# EAGLE design RPi_Extension_load (EAGLE 7.6.0)
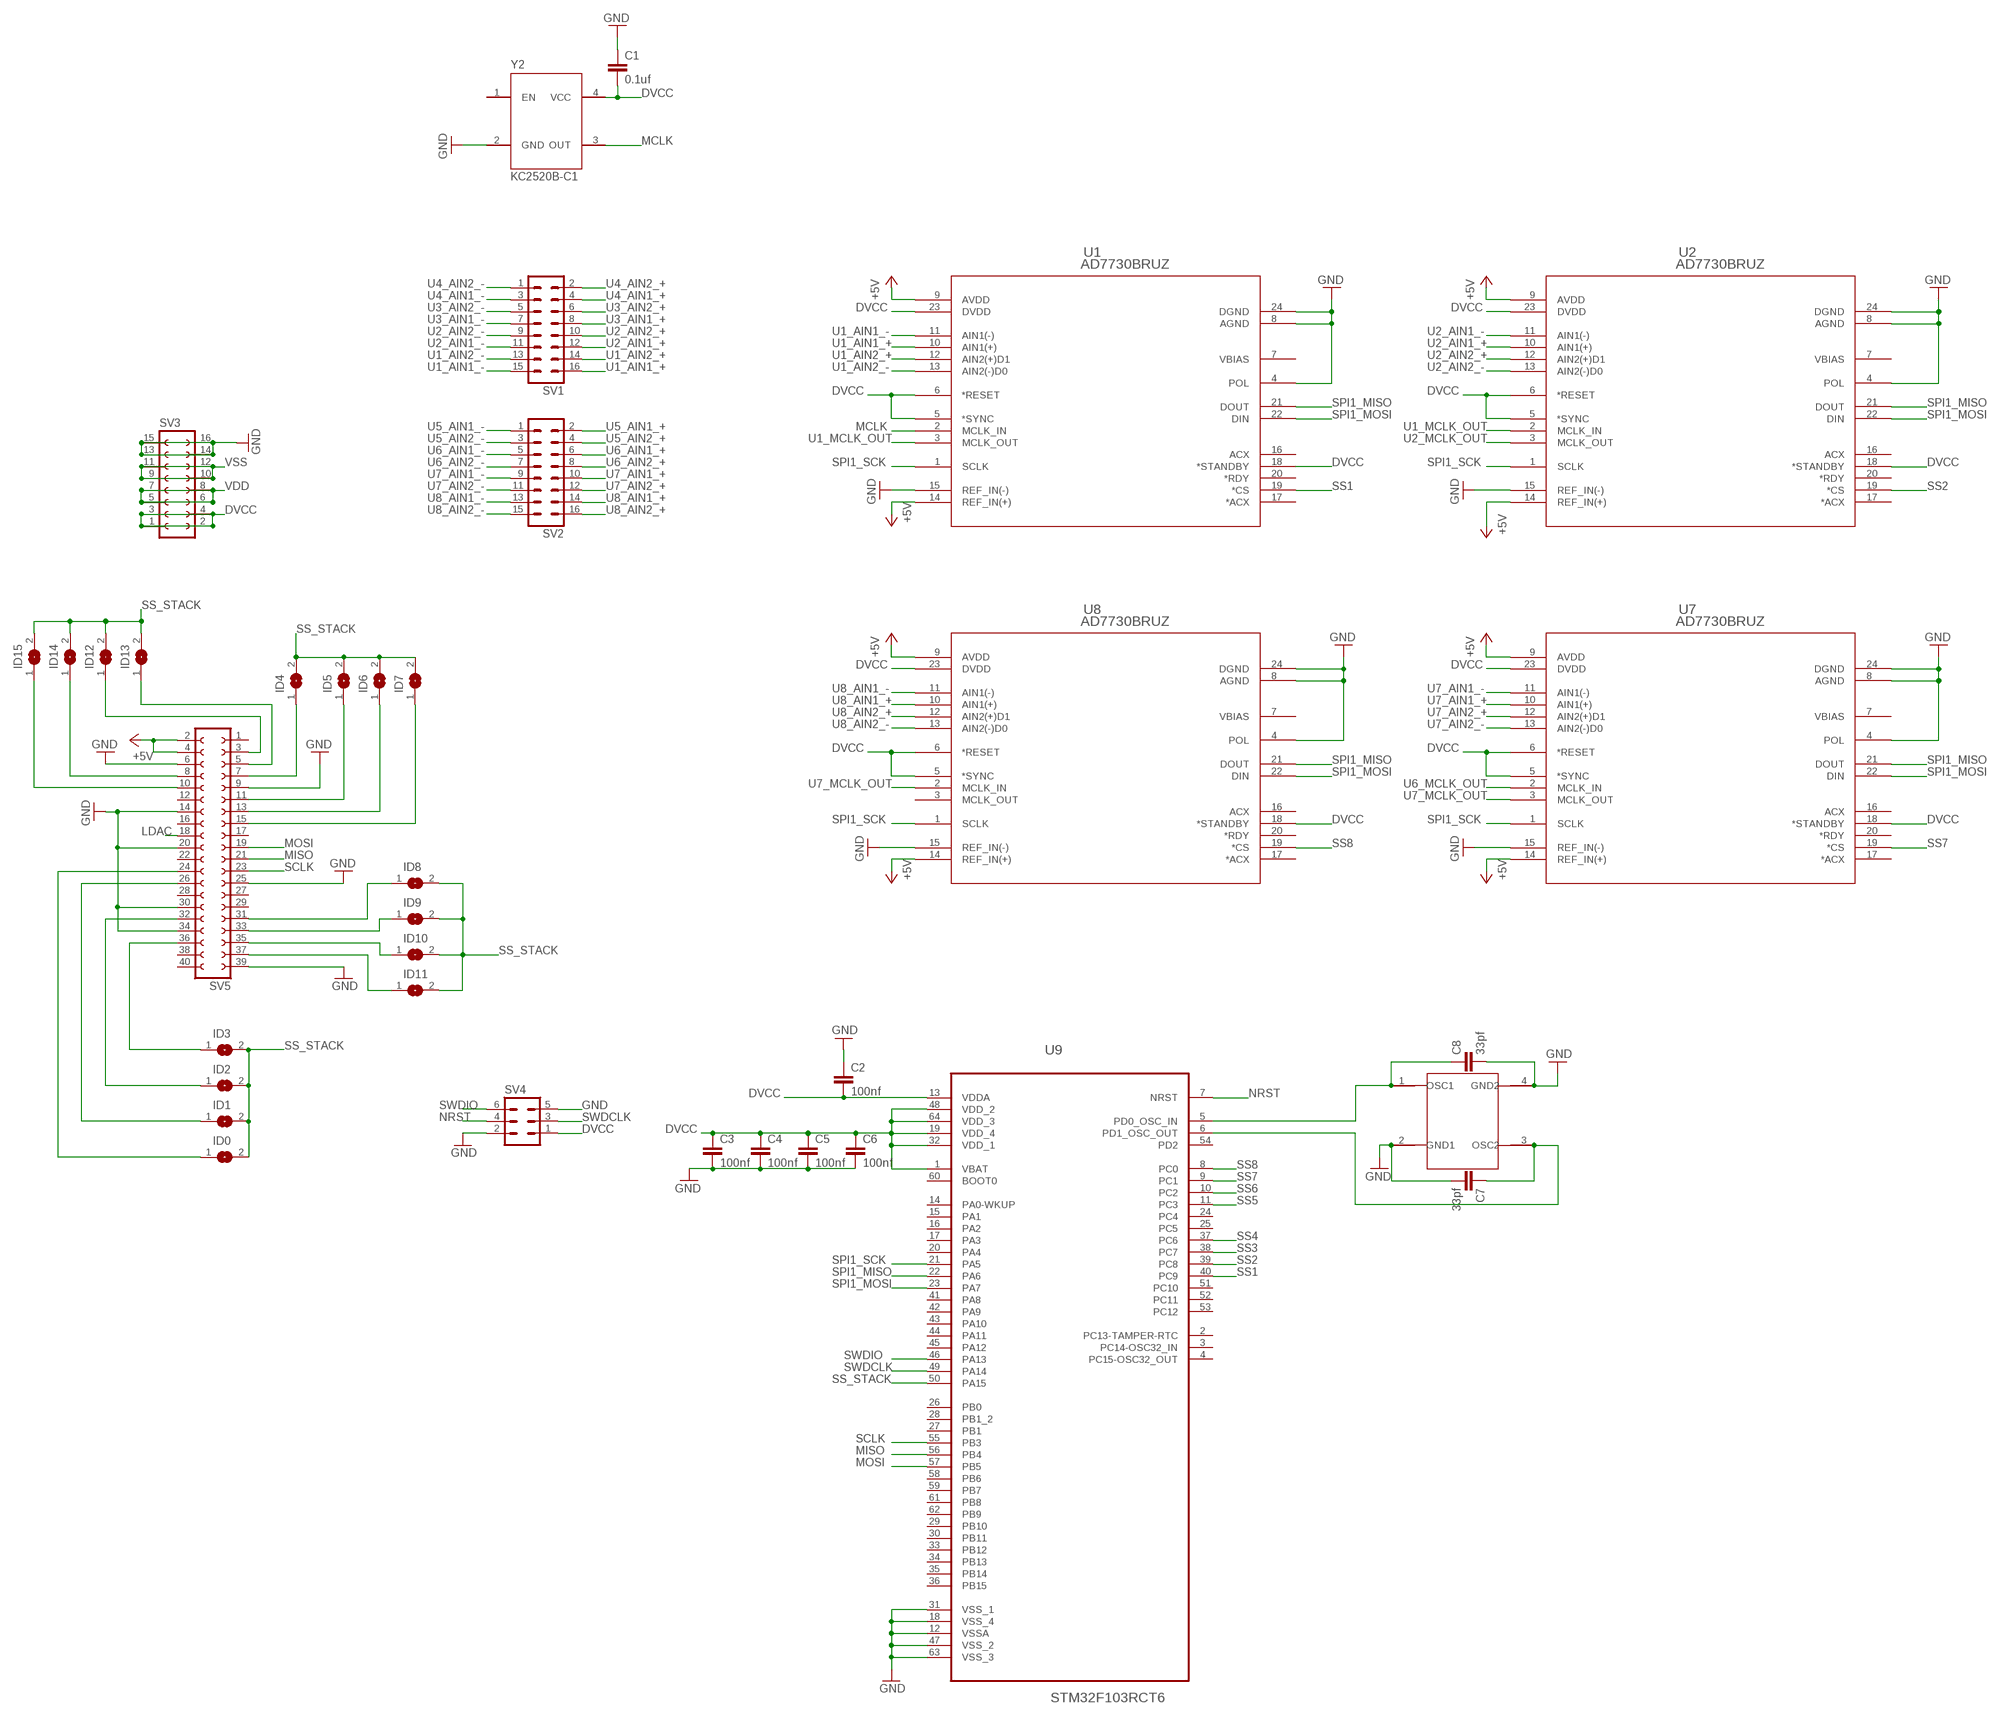
[diagram p0: schematic, sheet 1, part 1 of 2]
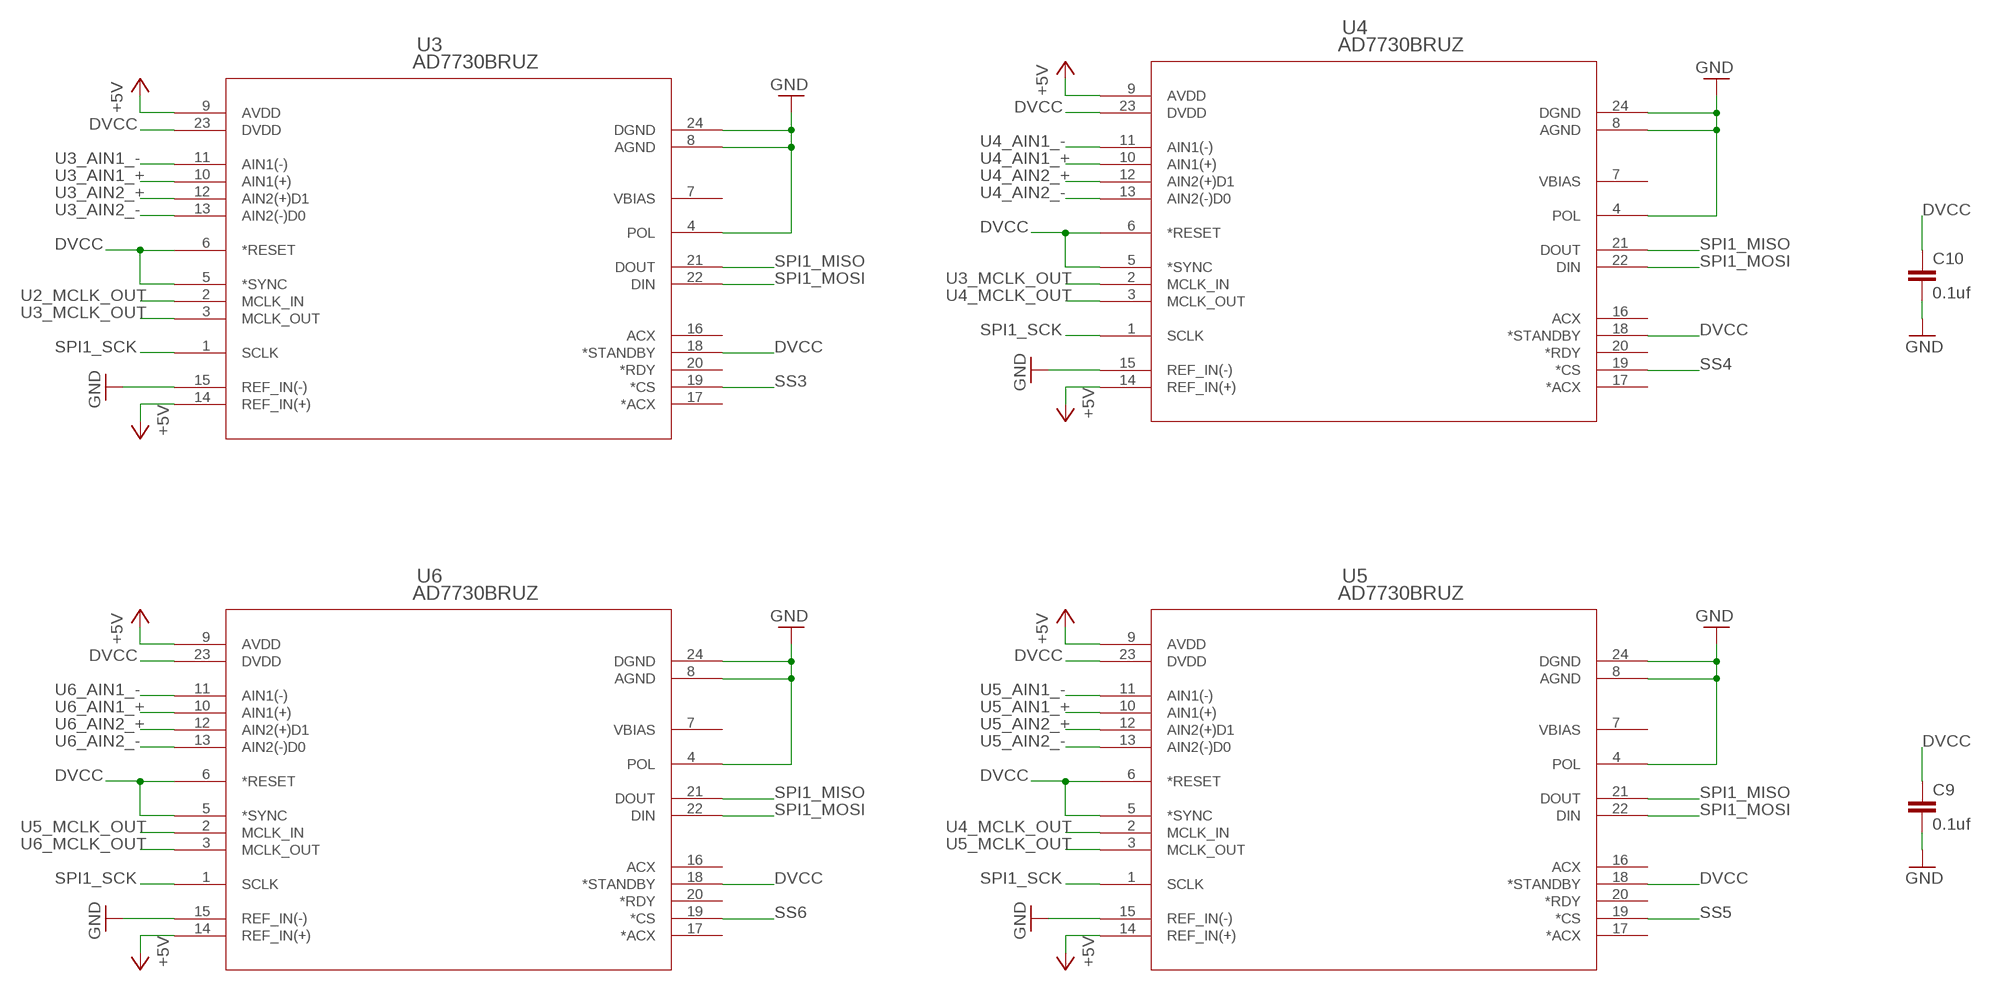
[diagram p1: schematic, sheet 1, part 2 of 2]

## Parts
C1  0.1uf  C-EUC0603  [C0603]
C2  100nf  C-EUC0603  [C0603]
C3  100nf  C-EUC0603  [C0603]
C4  100nf  C-EUC0603  [C0603]
C5  100nf  C-EUC0603  [C0603]
C6  100nf  C-EUC0603  [C0603]
C7  33pf  C-EUC0603  [C0603]
C8  33pf  C-EUC0603  [C0603]
C9  0.1uf  C-EUC0603  [C0603]
C10  0.1uf  C-EUC0603  [C0603]
ID0  SJ  [SJ]
ID1  SJ  [SJ]
ID2  SJ  [SJ]
ID3  SJ  [SJ]
ID4  SJ  [SJ]
ID5  SJ  [SJ]
ID6  SJ  [SJ]
ID7  SJ  [SJ]
ID8  SJ  [SJ]
ID9  SJ  [SJ]
ID10  SJ  [SJ]
ID11  SJ  [SJ]
ID12  SJ  [SJ]
ID13  SJ  [SJ]
ID14  SJ  [SJ]
ID15  SJ  [SJ]
SV1  MA08-2W  [MA08-2W]
SV2  MA08-2W  [MA08-2W]
SV3  FE08-2  [FE08-2]
SV4  MA03-2  [MA03-2]
SV5  FE20-2  [FE20-2]
U1  AD7730BRUZ  [RU_24]
U2  AD7730BRUZ  [RU_24]
U3  AD7730BRUZ  [RU_24]
U4  AD7730BRUZ  [RU_24]
U5  AD7730BRUZ  [RU_24]
U6  AD7730BRUZ  [RU_24]
U7  AD7730BRUZ  [RU_24]
U8  AD7730BRUZ  [RU_24]
U9  STM32F103RCT6  [QFP50P1200X1200X160-64N]
Y1  ABM3B  [ABM3B]
Y2  KC2520B-C1  [KC2520B-C1]

## Nets
+5V: SV5.2 SV5.4 U1.9(AVDD) U1.14(REF_IN(+)) U2.9(AVDD) U2.14(REF_IN(+)) U3.9(AVDD) U3.14(REF_IN(+)) U4.9(AVDD) U4.14(REF_IN(+)) U5.9(AVDD) U5.14(REF_IN(+)) U6.9(AVDD) U6.14(REF_IN(+)) U7.9(AVDD) U7.14(REF_IN(+)) U8.9(AVDD) U8.14(REF_IN(+))
DVCC: C1.2 C2.2 C3.1 C4.1 C5.1 C6.1 C9.1 C10.1 SV3.1 SV3.2 SV3.3 SV3.4 SV4.1 U1.5(*SYNC) U1.6(*RESET) U1.18(*STANDBY) U1.23(DVDD) U2.5(*SYNC) U2.6(*RESET) U2.18(*STANDBY) U2.23(DVDD) U3.5(*SYNC) U3.6(*RESET) U3.18(*STANDBY) U3.23(DVDD) U4.5(*SYNC) U4.6(*RESET) U4.18(*STANDBY) U4.23(DVDD) U5.5(*SYNC) U5.6(*RESET) U5.18(*STANDBY) U5.23(DVDD) U6.5(*SYNC) U6.6(*RESET) U6.18(*STANDBY) U6.23(DVDD) U7.5(*SYNC) U7.6(*RESET) U7.18(*STANDBY) U7.23(DVDD) U8.5(*SYNC) U8.6(*RESET) U8.18(*STANDBY) U8.23(DVDD) U9.1(VBAT) U9.13(VDDA) U9.19(VDD_4) U9.32(VDD_1) U9.48(VDD_2) U9.64(VDD_3) Y2.4(VCC)
GND: C1.1 C2.1 C3.2 C4.2 C5.2 C6.2 C7.2 C8.2 C9.2 C10.2 SV3.13 SV3.14 SV3.15 SV3.16 SV4.2 SV4.5 SV5.6 SV5.9 SV5.14 SV5.20 SV5.25 SV5.30 SV5.34 SV5.39 U1.4(POL) U1.8(AGND) U1.15(REF_IN(-)) U1.24(DGND) U2.4(POL) U2.8(AGND) U2.15(REF_IN(-)) U2.24(DGND) U3.4(POL) U3.8(AGND) U3.15(REF_IN(-)) U3.24(DGND) U4.4(POL) U4.8(AGND) U4.15(REF_IN(-)) U4.24(DGND) U5.4(POL) U5.8(AGND) U5.15(REF_IN(-)) U5.24(DGND) U6.4(POL) U6.8(AGND) U6.15(REF_IN(-)) U6.24(DGND) U7.4(POL) U7.8(AGND) U7.15(REF_IN(-)) U7.24(DGND) U8.4(POL) U8.8(AGND) U8.15(REF_IN(-)) U8.24(DGND) U9.12(VSSA) U9.18(VSS_4) U9.31(VSS_1) U9.47(VSS_2) U9.63(VSS_3) Y1.2(GND1) Y1.4(GND2) Y2.2(GND)
LDAC: SV5.18
MCLK: U1.2(MCLK_IN) Y2.3(OUT)
MISO: SV5.21 U9.56(PB4)
MOSI: SV5.19 U9.57(PB5)
N$1: ID11.1 SV5.37
N$2: C8.1 U9.5(PD0_OSC_IN) Y1.1(OSC1)
N$3: C7.1 U9.6(PD1_OSC_OUT) Y1.3(OSC2)
N$4: ID10.1 SV5.35
N$5: ID9.1 SV5.33
N$6: ID8.1 SV5.31
N$7: ID14.1 SV5.8
N$8: ID15.1 SV5.10
N$9: ID12.1 SV5.3
N$10: ID13.1 SV5.5
N$20: ID3.1 SV5.36
N$21: ID4.1 SV5.7
N$22: ID2.1 SV5.32
N$23: ID1.1 SV5.26
N$24: ID0.1 SV5.24
N$25: ID5.1 SV5.11
N$26: ID6.1 SV5.13
N$27: ID7.1 SV5.15
NRST: SV4.4 U9.7(NRST)
SCLK: SV5.23 U9.55(PB3)
SPI1_MISO: U1.21(DOUT) U2.21(DOUT) U3.21(DOUT) U4.21(DOUT) U5.21(DOUT) U6.21(DOUT) U7.21(DOUT) U8.21(DOUT) U9.22(PA6)
SPI1_MOSI: U1.22(DIN) U2.22(DIN) U3.22(DIN) U4.22(DIN) U5.22(DIN) U6.22(DIN) U7.22(DIN) U8.22(DIN) U9.23(PA7)
SPI1_SCK: U1.1(SCLK) U2.1(SCLK) U3.1(SCLK) U4.1(SCLK) U5.1(SCLK) U6.1(SCLK) U7.1(SCLK) U8.1(SCLK) U9.21(PA5)
SS1: U1.19(*CS) U9.40(PC9)
SS2: U2.19(*CS) U9.39(PC8)
SS3: U3.19(*CS) U9.38(PC7)
SS4: U4.19(*CS) U9.37(PC6)
SS5: U5.19(*CS) U9.11(PC3)
SS6: U6.19(*CS) U9.10(PC2)
SS7: U7.19(*CS) U9.9(PC1)
SS8: U8.19(*CS) U9.8(PC0)
SS_STACK: ID0.2 ID1.2 ID2.2 ID3.2 ID4.2 ID5.2 ID6.2 ID7.2 ID8.2 ID9.2 ID10.2 ID11.2 ID12.2 ID13.2 ID14.2 ID15.2 U9.50(PA15)
SWDCLK: SV4.3 U9.49(PA14)
SWDIO: SV4.6 U9.46(PA13)
U1_AIN1_+: SV1.16 U1.10(AIN1(+))
U1_AIN1_-: SV1.15 U1.11(AIN1(-))
U1_AIN2_+: SV1.14 U1.12(AIN2(+)D1)
U1_AIN2_-: SV1.13 U1.13(AIN2(-)D0)
U1_MCLK_OUT: U1.3(MCLK_OUT) U2.2(MCLK_IN)
U2_AIN1_+: SV1.12 U2.10(AIN1(+))
U2_AIN1_-: SV1.11 U2.11(AIN1(-))
U2_AIN2_+: SV1.10 U2.12(AIN2(+)D1)
U2_AIN2_-: SV1.9 U2.13(AIN2(-)D0)
U2_MCLK_OUT: U2.3(MCLK_OUT) U3.2(MCLK_IN)
U3_AIN1_+: SV1.8 U3.10(AIN1(+))
U3_AIN1_-: SV1.7 U3.11(AIN1(-))
U3_AIN2_+: SV1.6 U3.12(AIN2(+)D1)
U3_AIN2_-: SV1.5 U3.13(AIN2(-)D0)
U3_MCLK_OUT: U3.3(MCLK_OUT) U4.2(MCLK_IN)
U4_AIN1_+: SV1.4 U4.10(AIN1(+))
U4_AIN1_-: SV1.3 U4.11(AIN1(-))
U4_AIN2_+: SV1.2 U4.12(AIN2(+)D1)
U4_AIN2_-: SV1.1 U4.13(AIN2(-)D0)
U4_MCLK_OUT: U4.3(MCLK_OUT) U5.2(MCLK_IN)
U5_AIN1_+: SV2.2 U5.10(AIN1(+))
U5_AIN1_-: SV2.1 U5.11(AIN1(-))
U5_AIN2_+: SV2.4 U5.12(AIN2(+)D1)
U5_AIN2_-: SV2.3 U5.13(AIN2(-)D0)
U5_MCLK_OUT: U5.3(MCLK_OUT) U6.2(MCLK_IN)
U6_AIN1_+: SV2.6 U6.10(AIN1(+))
U6_AIN1_-: SV2.5 U6.11(AIN1(-))
U6_AIN2_+: SV2.8 U6.12(AIN2(+)D1)
U6_AIN2_-: SV2.7 U6.13(AIN2(-)D0)
U6_MCLK_OUT: U6.3(MCLK_OUT) U7.2(MCLK_IN)
U7_AIN1_+: SV2.10 U7.10(AIN1(+))
U7_AIN1_-: SV2.9 U7.11(AIN1(-))
U7_AIN2_+: SV2.12 U7.12(AIN2(+)D1)
U7_AIN2_-: SV2.11 U7.13(AIN2(-)D0)
U7_MCLK_OUT: U7.3(MCLK_OUT) U8.2(MCLK_IN)
U8_AIN1_+: SV2.14 U8.10(AIN1(+))
U8_AIN1_-: SV2.13 U8.11(AIN1(-))
U8_AIN2_+: SV2.16 U8.12(AIN2(+)D1)
U8_AIN2_-: SV2.15 U8.13(AIN2(-)D0)
VDD: SV3.5 SV3.6 SV3.7 SV3.8
VSS: SV3.9 SV3.10 SV3.11 SV3.12
Unconnected: SV5.1 SV5.12 SV5.16 SV5.17 SV5.22 SV5.27 SV5.28 SV5.29 SV5.38 SV5.40 U1.7(VBIAS) U1.16(ACX) U1.17(*ACX) U1.20(*RDY) U2.7(VBIAS) U2.16(ACX) U2.17(*ACX) U2.20(*RDY) U3.7(VBIAS) U3.16(ACX) U3.17(*ACX) U3.20(*RDY) U4.7(VBIAS) U4.16(ACX) U4.17(*ACX) U4.20(*RDY) U5.7(VBIAS) U5.16(ACX) U5.17(*ACX) U5.20(*RDY) U6.7(VBIAS) U6.16(ACX) U6.17(*ACX) U6.20(*RDY) U7.7(VBIAS) U7.16(ACX) U7.17(*ACX) U7.20(*RDY) U8.3(MCLK_OUT) U8.7(VBIAS) U8.16(ACX) U8.17(*ACX) U8.20(*RDY) U9.2(PC13-TAMPER-RTC) U9.3(PC14-OSC32_IN) U9.4(PC15-OSC32_OUT) U9.14(PA0-WKUP) U9.15(PA1) U9.16(PA2) U9.17(PA3) U9.20(PA4) U9.24(PC4) U9.25(PC5) U9.26(PB0) U9.27(PB1) U9.28(PB1_2) U9.29(PB10) U9.30(PB11) U9.33(PB12) U9.34(PB13) U9.35(PB14) U9.36(PB15) U9.41(PA8) U9.42(PA9) U9.43(PA10) U9.44(PA11) U9.45(PA12) U9.51(PC10) U9.52(PC11) U9.53(PC12) U9.54(PD2) U9.58(PB6) U9.60(BOOT0) U9.61(PB8) U9.62(PB9) Y2.1(EN)

## Power pins joined to a net without a drawn wire
PB7: U9.59(PB7)

## Library data of the parts
C1-C10 = rcl:C-EU: CAPACITOR, European symbol
ID0 ID1-ID15 = jumper:SJ: SMD solder JUMPER
SV1 SV2 = con-lstb:MA08-2W: PIN HEADER; OC_FARNELL: unknown; OC_NEWARK: unknown
SV3 = con-lsta:FE08-2: FEMALE HEADER; OC_FARNELL: unknown; OC_NEWARK: unknown
SV4 = con-lstb:MA03-2: PIN HEADER; OC_FARNELL: unknown; OC_NEWARK: unknown
SV5 = con-lsta:FE20-2: FEMALE HEADER; OC_FARNELL: unknown; OC_NEWARK: unknown
U1-U8 = AD7730BRUZ:AD7730BRUZ
U9 = STM32F103RCT6:STM32F103RCT6: ARM-based 32-bit MCU; MPN: STM32F103RCT6; OC_FARNELL: 1624136; OC_NEWARK: 01P4099; PACKAGE: QFP-64; SUPPLIER: STMICROELECTRONICS
Y1 = ABM3B:ABM3B
Y2 = kc2520b_c1:KC2520B-C1

## Board
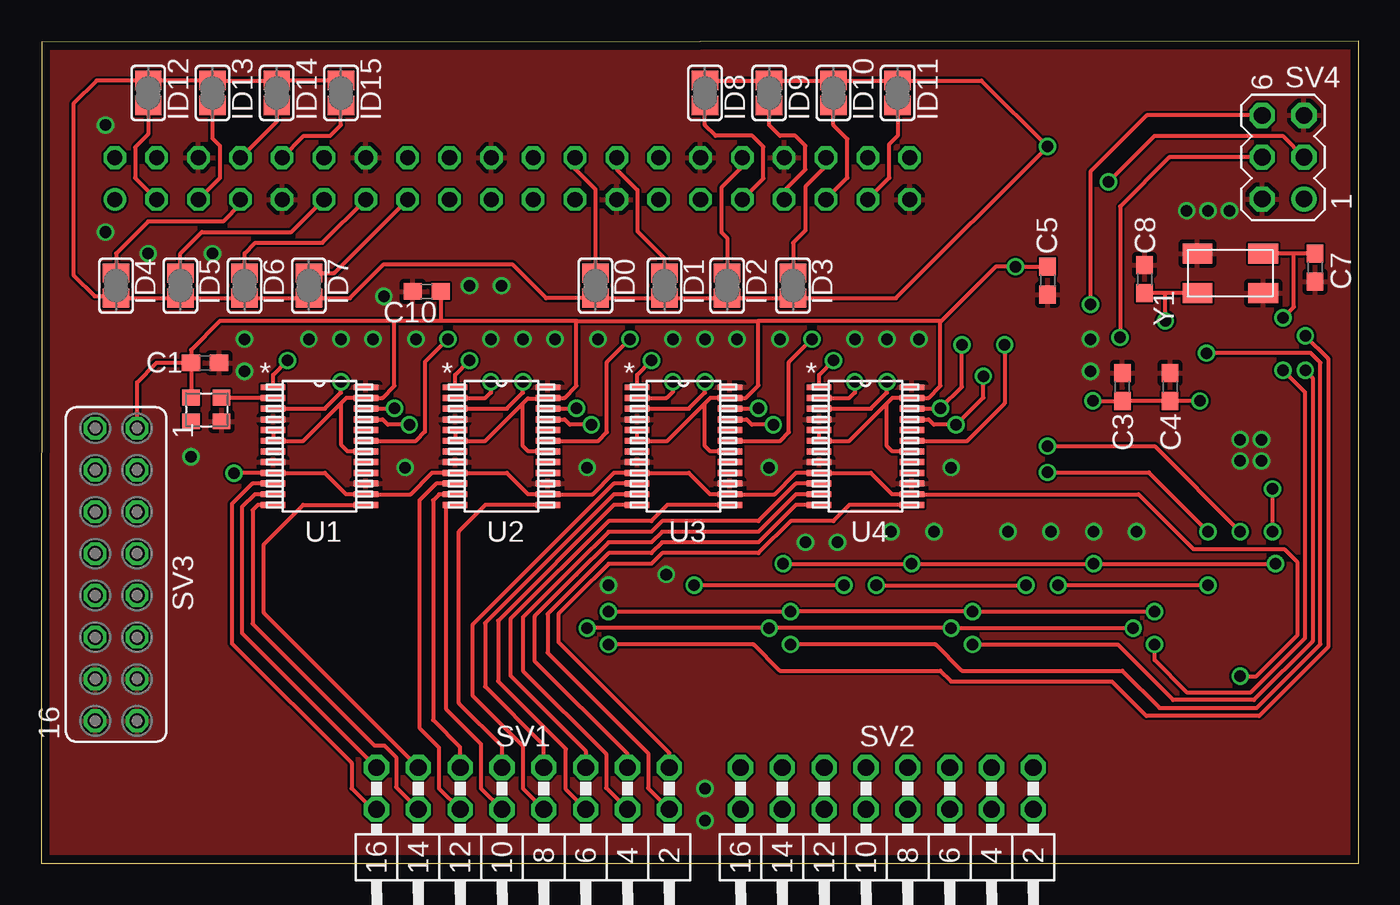
[diagram p2: board, top side]
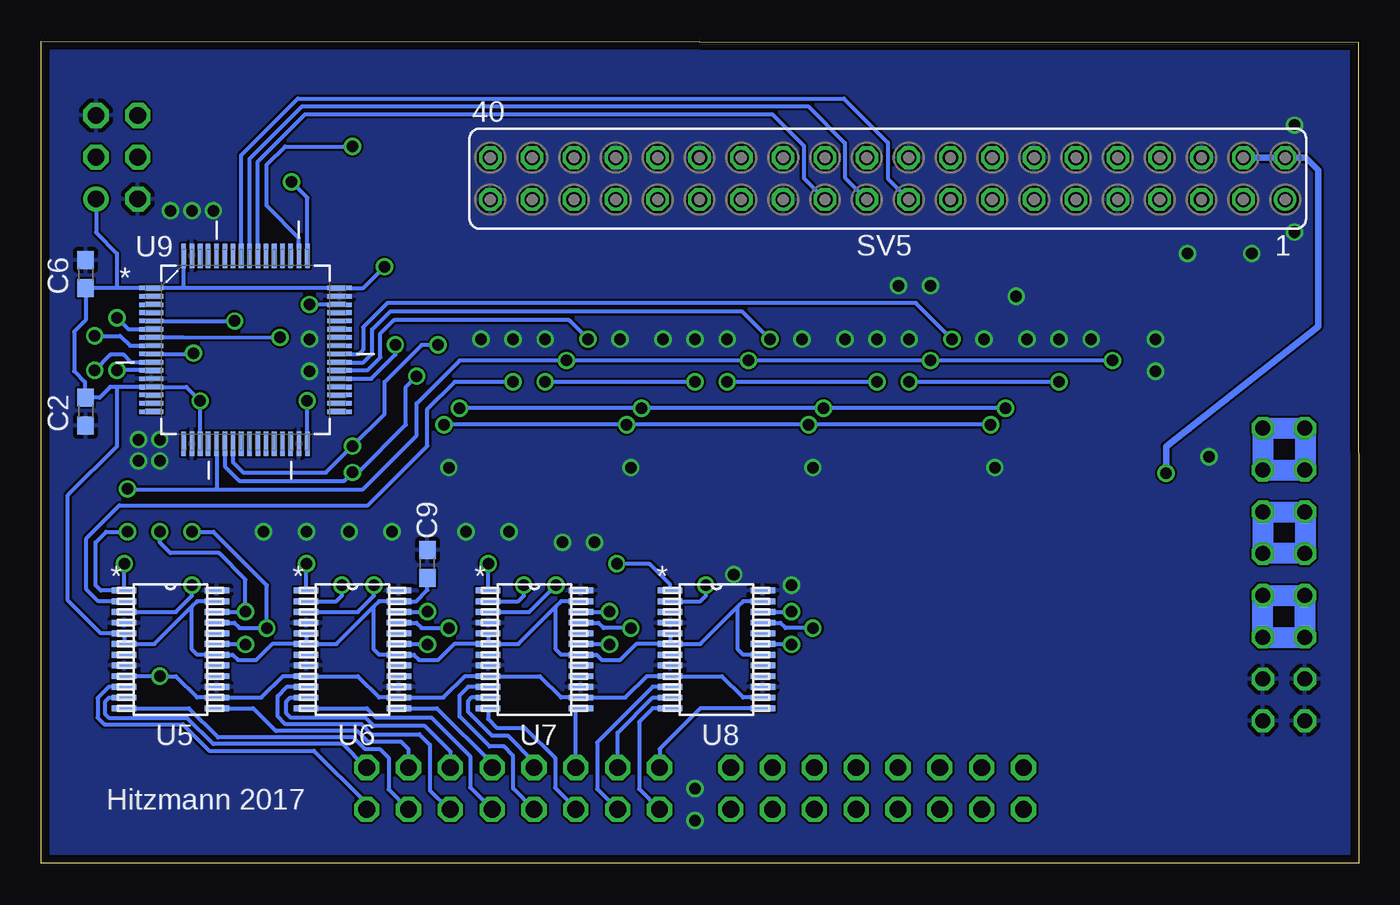
[diagram p3: board, bottom side, seen from below]

Size 80 x 49.95 mm. Coordinates in mm from the lower left corner, seen from the top.
Outline: 0,0 80,0 80,49.95 0.05,49.9 0,0
Copper layers (1*16): Top 0.135mm / dielectric 1.53mm / Bottom 0.135mm
Design rules "pban_4mil-l2 *": minimum track width 0.1mm, minimum drill 0.3mm, track to track 0.13mm, track to pad 0.229mm, pad to pad 0.13mm, via to via 0.13mm, smd to smd 0.1mm, copper to edge 0.5mm, drill to drill 0.5mm, minimum pad ring 0.15mm, minimum via ring 0.15mm, stop-mask expansion 4mil, vias tented up to drill 0.35mm, thermal gap 10mil

### Footprints (pad centres in the part's own frame; a part is rotated, then mirrored left to right if it is on the bottom)
C0603 = smd 1.1 x 1: 1 -0.85,0; 2 0.85,0
SJ = smd 1.168 x 1.6: 1 -0.762,0; 2 0.762,0
MA08-2W = drill 1.016 octagon: 1 -8.89,-1.27; 2 -8.89,1.27; 3 -6.35,-1.27; 4 -6.35,1.27; 5 -3.81,-1.27; 6 -3.81,1.27; 7 -1.27,-1.27; 8 -1.27,1.27; 9 1.27,-1.27; 10 1.27,1.27; 11 3.81,-1.27; 12 3.81,1.27; 13 6.35,-1.27; 14 6.35,1.27; 15 8.89,-1.27; 16 8.89,1.27
FE08-2 = drill 0.914 octagon: 1 -8.89,1.27; 2 -8.89,-1.27; 3 -6.35,1.27; 4 -6.35,-1.27; 5 -3.81,1.27; 6 -3.81,-1.27; 7 -1.27,1.27; 8 -1.27,-1.27; 9 1.27,1.27; 10 1.27,-1.27; 11 3.81,1.27; 12 3.81,-1.27; 13 6.35,1.27; 14 6.35,-1.27; 15 8.89,1.27; 16 8.89,-1.27
MA03-2 = drill 1.016: 1 -2.54,-1.27 | drill 1.016 octagon: 2 -2.54,1.27; 3 0,-1.27; 4 0,1.27; 5 2.54,-1.27; 6 2.54,1.27
FE20-2 = drill 0.914: 1 -24.13,1.27 | drill 0.914 octagon: 2 -24.13,-1.27; 3 -21.59,1.27; 4 -21.59,-1.27; 5 -19.05,1.27; 6 -19.05,-1.27; 7 -16.51,1.27; 8 -16.51,-1.27; 9 -13.97,1.27; 10 -13.97,-1.27; 11 -11.43,1.27; 12 -11.43,-1.27; 13 -8.89,1.27; 14 -8.89,-1.27; 15 -6.35,1.27; 16 -6.35,-1.27; 17 -3.81,1.27; 18 -3.81,-1.27; 19 -1.27,1.27; 20 -1.27,-1.27; 21 1.27,1.27; 22 1.27,-1.27; 23 3.81,1.27; 24 3.81,-1.27; 25 6.35,1.27; 26 6.35,-1.27; 27 8.89,1.27; 28 8.89,-1.27; 29 11.43,1.27; 30 11.43,-1.27; 31 13.97,1.27; 32 13.97,-1.27; 33 16.51,1.27; 34 16.51,-1.27; 35 19.05,1.27; 36 19.05,-1.27; 37 21.59,1.27; 38 21.59,-1.27; 39 24.13,1.27; 40 24.13,-1.27
RU_24 = smd 1.473 x 0.356: 1 -2.819,3.575; 2 -2.819,2.925; 3 -2.819,2.275; 4 -2.819,1.625; 5 -2.819,0.975; 6 -2.819,0.325; 7 -2.819,-0.325; 8 -2.819,-0.975; 9 -2.819,-1.625; 10 -2.819,-2.275; 11 -2.819,-2.925; 12 -2.819,-3.575; 13 2.819,-3.575; 14 2.819,-2.925; 15 2.819,-2.275; 16 2.819,-1.625; 17 2.819,-0.975; 18 2.819,-0.325; 19 2.819,0.325; 20 2.819,0.975; 21 2.819,1.625; 22 2.819,2.275; 23 2.819,2.925; 24 2.819,3.575
QFP50P1200X1200X160-64N = smd 1.473 x 0.279: 1 -5.715,3.759; 2 -5.715,3.251; 3 -5.715,2.743; 4 -5.715,2.261; 5 -5.715,1.753; 6 -5.715,1.245; 7 -5.715,0.762; 8 -5.715,0.254; 9 -5.715,-0.254; 10 -5.715,-0.762; 11 -5.715,-1.245; 12 -5.715,-1.753; 13 -5.715,-2.261; 14 -5.715,-2.743; 15 -5.715,-3.251; 16 -5.715,-3.759; 33 5.715,-3.759; 34 5.715,-3.251; 35 5.715,-2.743; 36 5.715,-2.261; 37 5.715,-1.753; 38 5.715,-1.245; 39 5.715,-0.762; 40 5.715,-0.254; 41 5.715,0.254; 42 5.715,0.762; 43 5.715,1.245; 44 5.715,1.753; 45 5.715,2.261; 46 5.715,2.743; 47 5.715,3.251; 48 5.715,3.759 | smd 0.279 x 1.473: 17 -3.759,-5.715; 18 -3.251,-5.715; 19 -2.743,-5.715; 20 -2.261,-5.715; 21 -1.753,-5.715; 22 -1.245,-5.715; 23 -0.762,-5.715; 24 -0.254,-5.715; 25 0.254,-5.715; 26 0.762,-5.715; 27 1.245,-5.715; 28 1.753,-5.715; 29 2.261,-5.715; 30 2.743,-5.715; 31 3.251,-5.715; 32 3.759,-5.715; 49 3.759,5.715; 50 3.251,5.715; 51 2.743,5.715; 52 2.261,5.715; 53 1.753,5.715; 54 1.245,5.715; 55 0.762,5.715; 56 0.254,5.715; 57 -0.254,5.715; 58 -0.762,5.715; 59 -1.245,5.715; 60 -1.753,5.715; 61 -2.261,5.715; 62 -2.743,5.715; 63 -3.251,5.715; 64 -3.759,5.715
ABM3B = smd 1.8 x 1.2: 1 0,-2.4; 2 4,-2.4; 3 4,0; 4 0,0
KC2520B-C1 = smd 1.05 x 0.95: 1 0,-1.45; 2 1.85,-1.45; 3 1.85,0; 4 0,0

### Placement (x,y rotation side)
C1  100nF  [C0603]  9.95,30.4 180 top
C2  100nF  [C0603]  77.3,27.45 90 bottom
C3  100nF  [C0603]  65.65,28.95 90 top
C4  100nF  [C0603]  68.55,28.95 90 top
C5  100nF  [C0603]  61.1,35.4 270 top
C6  100nF  [C0603]  77.3,35.8 90 bottom
C7  77.35,36.2 270 top
C8  67,35.5 90 top
C9  100nF  [C0603]  56.55,18.2 90 bottom
C10  100nF  [C0603]  23.4,34.75 180 top
ID0  33.65,35.1 270 top
ID1  37.85,35.1 270 top
ID2  41.65,35.1 270 top
ID3  45.65,35.1 270 top
ID4  4.55,35.1 270 top
ID5  8.45,35.1 270 top
ID6  12.35,35.1 270 top
ID7  16.25,35.1 270 top
ID8  40.3,46.8 90 top
ID9  44.2,46.8 90 top
ID10  48.1,46.8 90 top
ID11  52,46.8 90 top
ID12  6.5,46.8 90 top
ID13  10.4,46.8 90 top
ID14  14.3,46.8 90 top
ID15  18.2,46.8 90 top
SV1  29.25,4.55 180 top
SV2  51.35,4.55 180 top
SV3  4.55,17.55 270 top
SV4  75.4,42.9 90 top
SV5  28.6,41.6 180 bottom
U1  16.9,25.35 0 top
U2  27.95,25.35 0 top
U3  39,25.35 0 top
U4  50.05,25.35 0 top
U5  72.15,13 0 bottom
U6  61.1,13 0 bottom
U7  50.05,13 0 bottom
U8  39,13 0 bottom
U9  67.6,31.2 0 bottom
Y1  70.2,37.05 0 top
Y2  9.1,28.3 0 top

### Tracks (layer width: path | path; a pad name or v marks a point on that pad's centre or on a via)
+5V  (via drill 0.7)
  Top 0.254: 11.72,23.73 U1.9 17.23,23.73 18.52,22.43 U1.14 22.43,22.43 23.73,23.73 U2.9 28.27,23.73 29.57,22.43 U2.14 33.48,22.43 34.77,23.73 U3.9 39.33,23.73 40.62,22.43 U3.14 44.52,22.43 45.83,23.73 U4.9 50.38,23.73 51.67,22.43 U4.14 66.62,22.43 69.95,19.1 75.47,19.1 76.25,18.32 76.25,13.85 73.78,11.38 v72.8,11.38
  Top 0.305: 11.72,23.73 v11.7,23.7
  Bottom 0.254: U8.14 37.38,10.07 38.67,11.38 U8.9 43.23,11.38 44.52,10.07 U7.14 48.42,10.07 49.73,11.38 U7.9 54.27,11.38 55.58,10.07 U6.14 59.48,10.07 60.77,11.38 U6.9 65.33,11.38 66.62,10.07 U5.14 70.53,10.07 71.83,11.38 v72.8,11.38 U5.9
  Bottom 0.406: v11.7,23.7 11.7,25.33 2.48,32.6 2.48,42.13 3.22,42.87 SV5.4 SV5.2
DVCC  (via drill 0.7)
  Top 0.254: C1.2 Y2.4 | 32.5,32.95 24.2,32.95 | 24.2,32.95 21.45,32.95 | 32.5,32.95 32.5,29 31.77,28.27 U2.23 30.74,28.25 29.55,28.25 29.25,27.95 | v63.85,28.1 C3.1 C4.1 68.76,28.09 v70.34,28.09 | U1.5 U1.6 15.93,25.68 18.2,27.95 | 18.2,27.95 18.52,28.27 U1.23 20.72,28.27 21.45,29 21.45,32.95 | 18.2,27.95 18.2,25.45 18.62,25.02 U1.18 | 29.25,27.95 26.98,25.68 U2.6 U2.5 | U2.18 29.57,25.02 29.25,25.35 29.25,27.95 | 40.3,27.95 38.02,25.68 U3.6 U3.5 | 40.3,27.95 40.62,28.27 U3.23 42.79,28.27 43.55,29.04 43.55,32.95 | U3.18 40.62,25.02 40.3,25.35 40.3,27.95 | 32.5,32.95 43.55,32.95 | 43.55,32.95 54.55,32.95 54.6,32.9 | 51.35,27.95 49.08,25.68 U4.6 U4.5 | 51.35,27.95 51.67,28.27 U4.23 53.88,28.27 54.6,29 54.6,32.9 | U4.18 51.67,25.02 51.35,25.35 51.35,27.95 | 21.45,32.95 10.85,32.95 9.1,31.2 C1.2 | C5.1 v59.15,36.25 57.95,36.25 54.6,32.9 | SV3.1 5.82,29.22 7,30.4 C1.2 | C10.1 24.25,33 24.2,32.95
  Bottom 0.254: 71.36,34.96 U9.48 60.44,34.96 v59.15,36.25 | 71.36,34.96 U9.1 75.4,34.96 | U9.19 v70.34,28.09 71.19,28.94 U9.13 75.4,28.94 | U9.64 71.36,34.96 | 70.85,15.6 70.85,13 70.53,12.68 U5.18 68.38,12.68 68.05,12.35 66.95,12.35 65.97,13.32 U6.6 | U5.23 70.53,15.93 70.85,15.6 | 70.85,15.6 73.12,13.32 U5.6 U5.5 76.38,13.97 78.37,15.97 78.37,22.38 75.39,25.36 75.39,28.93 75.4,28.94 | U9.32 v63.84,28.09 v63.85,28.1 | SV4.1 76.67,38.32 75.4,37.05 75.4,34.96 | 59.8,15.6 59.48,15.93 U6.23 57.23,15.93 56.55,16.6 C9.1 | 59.8,15.6 62.08,13.32 U6.6 | U6.5 U6.6 | 59.8,15.6 59.8,13 59.48,12.68 U6.18 57.38,12.68 57.05,12.35 55.9,12.35 54.92,13.32 U7.6 | U7.5 U7.6 | U8.5 U8.6 | U8.6 43.88,13.32 44.85,12.35 45.95,12.35 46.27,12.68 U7.18 48.42,12.68 48.75,13 48.75,15.6 | U8.23 37.38,15.93 37.7,15.6 | 37.7,15.6 39.98,13.32 U8.6 | U7.23 48.42,15.93 48.75,15.6 | 48.75,15.6 51.02,13.32 U7.6 | U8.18 37.38,12.68 37.7,13 37.7,15.6 | 75.4,34.96 C6.1 77.3,33 78,32.3 78,29.9 77.35,29.25 77.35,28.35 C2.2 76.45,28.3 75.81,28.94 75.4,28.94
  Bottom 0.406: SV3.2 SV3.1
  Bottom 1.27: SV3.4 SV3.3 SV3.1 3.25,26.44 3.25,24.05
GND  (via drill 0.7)
  other vias: 6.5,37.05 10.4,37.05 63.7,31.85 20.15,31.85 22.75,31.85 31.2,31.85 33.8,31.85 42.25,31.85 44.85,31.85 53.3,31.85 54.2,20.15 63.9,20.15 63.7,29.9 3.9,38.35 3.9,44.85 51.6,20.15 61.3,20.15 72.8,24.45 72.8,25.75 74.1,25.75 74.1,24.45 69.55,39.65 70.85,39.65 9.1,24.7 72.15,39.65 18.2,31.85 16.25,31.85 29.25,31.85 27.3,31.85 51.35,31.85 49.4,31.85 20.8,34.45 26,35.1 27.95,35.1 40.3,31.85 38.35,31.85 58.7,20.15 66.5,20.15 48.35,19.5 46.4,19.5 37.95,17.55 34.45,16.9 22.1,24.05 33.15,24.05 44.2,24.05 55.25,24.05 12.35,31.85 12.35,29.9 40.3,4.55 40.3,2.6
  pour Top: -0.65,-0.65 81.25,-0.65 81.25,50.05 -0.65,50.05
  pour Bottom: 0,0 0,50.05 79.95,50.05 79.95,0
MCLK
  Top 0.254: U1.2 10.97,28.27
  Top 0.305: 10.97,28.27 Y2.3
MISO
  Bottom 0.254: U9.56 67.35,42.81 64.16,45.99 33.43,45.99 31.2,43.76 31.2,41.66 SV5.21
MOSI
  Bottom 0.254: U9.57 67.85,43.02 64.41,46.47 31.27,46.47 28.6,43.8 28.6,41.6 SV5.19
N$1
  Top 0.254: SV5.37 51.5,41.65 51.5,43.7 52,44.2 ID11.1
N$2  (via drill 0.7)
  Top 0.254: v68.25,32.95 68.25,34.65 | 68.25,34.65 C8.1 | Y1.1 68.25,34.65
  Bottom 0.254: U9.5 v68.25,32.95
N$3  (via drill 0.7)
  Top 0.254: v75.4,33.15 76.05,33.8 76.05,37.05 | 76.05,37.05 Y1.3 | C7.1 76.05,37.05
  Bottom 0.254: U9.6 74.69,32.45 v75.4,33.15
N$4
  Top 0.254: SV5.35 47.65,40.35 48.95,41.65 48.95,44 48.1,44.85 ID10.1
N$5
  Top 0.254: SV5.33 45.11,40.86 46.4,42.15 46.4,43.59 45.79,44.2 44.85,44.2 44.2,44.85 ID9.1
N$6
  Top 0.254: SV5.31 43.85,41.6 43.85,43.53 43.18,44.2 40.95,44.2 40.3,44.85 ID8.1
N$7
  Top 0.254: SV5.8 12.12,42.87 14.3,45.05 ID14.1
N$8
  Top 0.254: SV5.10 15.95,44.2 17.55,44.2 18.2,44.85 ID15.1
N$9
  Top 0.254: ID12.1 6.5,44.3 5.7,43.5 5.7,41.64 SV5.3
N$10
  Top 0.254: ID13.1 10.4,44.05 10.85,43.6 10.85,41.63 SV5.5
N$20
  Top 0.254: SV5.36 47.65,42.35 46.4,41.1 46.4,38.45 45.65,37.7 ID3.1
N$21
  Top 0.254: SV5.7 12.09,40.04 11.05,39 6.5,39 4.55,37.05 ID4.1
N$22
  Top 0.254: SV5.32 42.57,42.32 41.3,41.05 41.3,38.35 41.65,38 ID2.1
  Top 0.406: 41.75,36.25 ID2.1
N$23
  Top 0.254: SV5.26 34.95,42.15 36.2,40.9 36.2,38.4 37.85,36.75 ID1.1
N$24
  Top 0.254: SV5.24 32.41,42.19 33.65,40.95 ID0.1
N$25
  Top 0.254: ID5.1 8.45,37.05 9.75,38.35 15.19,38.35 SV5.11
N$26
  Top 0.254: ID6.1 12.35,37.05 13,37.7 17.08,37.7 SV5.13
N$27
  Top 0.254: ID7.1 17.78,35.86 SV5.15
NRST  (via drill 0.7)
  Top 0.254: SV4.4 68.49,42.9 65.5,39.91 v65.5,31.95
  Bottom 0.254: v65.5,31.95 71.36,31.96 U9.7
SCLK
  Bottom 0.254: U9.55 66.84,42.63 63.97,45.5 35.61,45.5 33.7,43.59 33.7,41.62 SV5.23
SPI1_MISO  (via drill 0.7)
  Top 0.254: U1.21 20.73,26.98 21.05,26.65 v22.35,26.65 | v33.4,26.65 32.1,26.65 31.77,26.98 U2.21 | v44.45,26.65 43.15,26.65 42.83,26.98 U3.21 | U4.21 53.88,26.98 54.2,26.65 v55.55,26.65 57.2,28.3 v57.2,29.6 | v66.3,14.3 v55.25,14.3 v44.2,14.3 v33.15,14.3 | v61.1,23.75 67.25,23.75 v70.85,20.15
  Bottom 0.254: v22.35,26.65 v33.4,26.65 v44.45,26.65 v55.55,26.65 | U9.22 68.84,24.12 67.96,23.24 61.61,23.24 v61.1,23.75 60.75,23.75 57.85,26.65 57.85,28.95 v57.2,29.6 | v70.85,20.15 69.55,20.15 66.3,16.9 v66.3,14.3 67.95,14.3 68.28,14.62 U5.21 | U6.21 57.23,14.62 56.9,14.3 v55.25,14.3 | v44.2,14.3 45.85,14.3 46.17,14.62 U7.21 | v33.15,14.3 34.8,14.3 35.12,14.62 U8.21
SPI1_MOSI  (via drill 0.7)
  Top 0.254: U2.22 32.48,27.62 v32.5,27.65 | U3.22 43.52,27.62 v43.55,27.65 | U4.22 54.58,27.62 v54.6,27.65 55.9,28.95 v55.9,31.5 | v67.6,15.3 v56.55,15.3 v45.5,15.3 v34.45,15.3 | v61.1,25.35 67.6,25.35 v72.8,20.15 | U1.22 21.43,27.62 v21.45,27.65
  Bottom 0.254: U9.23 68.36,24.38 67.72,23.73 62.72,23.73 v61.1,25.35 59.15,27.3 59.15,29.25 56.9,31.5 v55.9,31.5 | v21.45,27.65 v32.5,27.65 v43.55,27.65 v54.6,27.65 | v72.8,20.15 72.8,19.5 72.15,18.85 69.2,18.85 67.6,17.25 v67.6,15.3 67.62,15.28 U5.22 | U6.22 56.58,15.28 v56.55,15.3 | U8.22 34.48,15.28 v34.45,15.3 | U7.22 45.52,15.28 v45.5,15.3
SPI1_SCK  (via drill 0.7)
  Top 0.254: U1.1 14.08,29.68 v14.95,30.55 | U2.1 25.13,29.68 v26,30.55 | U3.1 36.18,29.68 v37.05,30.55 | U4.1 47.23,29.68 v48.1,30.55 | v74.75,22.75 v74.75,20.15 | v74.95,18.2 v63.9,18.2 v52.85,18.2 v45.05,18.2
  Bottom 0.254: v14.95,30.55 v26,30.55 v37.05,30.55 v48.1,30.55 54.6,30.55 57.2,27.95 57.2,26 60.47,22.73 69.4,22.73 | U9.21 69.35,22.78 69.4,22.73 | 69.4,22.73 74.73,22.73 v74.75,22.75 | U6.1 63.92,18.18 v63.9,18.2 | v74.95,18.2 74.97,18.18 U5.1 76.38,16.57 76.7,16.9 76.7,19.5 76.05,20.15 v74.75,20.15 | U7.1 52.87,18.18 v52.85,18.2 | U8.1 41.82,16.94 43.06,18.19 v45.05,18.2
SS1  (via drill 0.7)
  Top 0.254: U1.19 22.75,25.68 23.3,26.23 23.3,30.45 v24.7,31.85
  Bottom 0.254: v24.7,31.85 26.89,34.04 58.98,34.04 60.45,32.58 60.45,31.2 60.7,30.95 U9.40
SS2  (via drill 0.7)
  Top 0.254: U2.19 33.83,25.68 34.35,26.2 34.35,30.45 v35.75,31.85
  Bottom 0.254: U9.39 60.44,30.44 59.9,30.98 59.9,32.43 58.81,33.52 37.42,33.52 v35.75,31.85
SS3  (via drill 0.7)
  Top 0.254: U3.19 44.88,25.68 45.4,26.2 45.4,30.45 v46.8,31.85
  Bottom 0.254: v46.8,31.85 47.95,33 58.59,33 59.4,32.19 59.4,30.73 60.18,29.95 U9.38
SS4  (via drill 0.7)
  Top 0.254: v58.5,31.5 58.5,27.95 56.23,25.68 U4.19
  Bottom 0.254: U9.37 59.96,29.45 58.5,30.91 v58.5,31.5
SS5  (via drill 0.7)
  Top 0.254: 67.6,13 v67.6,13.3 67.6,12.35 69.55,10.4 73.45,10.4 76.73,13.68 76.73,28.62 v75.4,29.95
  Bottom 0.254: U5.19 67.62,13.32 v67.6,13.3 | U9.11 v75.39,29.95 v75.4,29.95
SS6  (via drill 0.7)
  Top 0.254: v56.55,13.3 65.35,13.3 68.72,9.93 73.62,9.93 77.2,13.5 77.2,29.5 v76.75,29.95
  Bottom 0.254: U6.19 56.58,13.32 v56.55,13.3 | U9.10 74.54,30.44 75,30.9 75.8,30.9 v76.75,29.95
SS7  (via drill 0.7)
  Top 0.254: v70.75,31 70.81,31 77.08,31 77.66,30.42 77.66,13.31 73.79,9.44 67.91,9.44 65.65,11.7 55.9,11.7 54.3,13.3 v45.5,13.3
  Bottom 0.254: U7.19 45.52,13.32 v45.5,13.3 | U9.9 70.75,30.95 v70.75,31
SS8  (via drill 0.7)
  Top 0.254: v76.75,32.05 78.14,30.66 78.14,13.14 73.95,8.95 67.1,8.95 65,11.05 55.25,11.05 54.6,11.7 44.85,11.7 43.25,13.3 v34.45,13.3
  Bottom 0.254: U8.19 34.48,13.32 v34.45,13.3 | v76.75,32.05 75.2,32.05 74.6,31.45 U9.8
SS_STACK  (via drill 0.7)
  Top 0.254: ID8.2 ID9.2 ID10.2 ID11.2 57.09,47.56 v61.1,43.55 51.89,34.34 ID3.2 ID2.2 ID1.2 ID0.2 30.66,34.34 30.55,34.45 30.23,34.77 28.6,36.4 20.8,36.4 18.74,34.34 ID7.2 ID6.2 ID5.2 ID4.2 4.44,34.45 3.25,34.45 1.95,35.75 1.95,46.14 3.37,47.56 ID12.2 ID13.2 ID14.2 ID15.2
  Top 0.406: ID0.2
  Bottom 0.254: U9.50 64.35,38 66.33,39.98 66.33,42.42 65.2,43.55 v61.1,43.55
SWDCLK  (via drill 0.7)
  Top 0.254: v64.8,41.4 67.6,44.2 75.37,44.2 SV4.3
  Bottom 0.254: U9.49 63.84,40.44 v64.8,41.4
SWDIO  (via drill 0.7)
  Top 0.254: SV4.6 67.12,45.44 63.7,42.02 v63.7,33.95
  Bottom 0.254: U9.46 63.66,33.94 v63.7,33.95
U1_AIN1_+
  Top 0.254: U1.10 12.82,23.07 11.59,21.84 11.59,13.37 18.85,6.1 18.85,4.55 20.12,3.28 SV1.16
U1_AIN1_-
  Top 0.254: SV1.15 12.19,13.99 12.19,21.64 12.97,22.43 U1.11
U1_AIN2_+
  Top 0.254: U1.12 13.16,21.77 12.85,21.46 12.85,14.55 20.25,7.15 20.85,7.15 21.55,6.45 21.55,4.63 SV1.14
U1_AIN2_-
  Top 0.254: U1.13 15.91,21.77 13.52,19.39 13.52,15.23 22.9,5.85 SV1.13
U1_MCLK_OUT  (via drill 0.7)
  Top 0.254: U1.3 17.23,27.62 18.2,28.6 v18.2,29.25 | v27.3,29.25 27.3,28.6 26.98,28.27 U2.2
  Bottom 0.254: v18.2,29.25 v27.3,29.25
U2_AIN1_+
  Top 0.254: U2.10 23.98,23.07 22.96,22.06 22.96,8.24 24.15,7.05 24.15,4.57 SV1.12
U2_AIN1_-
  Top 0.254: U2.11 24.16,22.43 23.79,22.05 23.79,8.71 25.44,7.06 SV1.11
U2_AIN2_+
  Top 0.254: SV1.10 26.7,4.56 26.7,7.25 24.6,9.35 24.6,21.75 24.55,21.8 25.11,21.8 U2.12
U2_AIN2_-
  Top 0.254: SV1.9 27.98,7.12 25.36,9.74 25.36,20.16 26.98,21.77 U2.13
U2_MCLK_OUT  (via drill 0.7)
  Top 0.254: U2.3 28.27,27.62 29.25,28.6 v29.25,29.25 | v38.35,29.25 38.35,28.65 37.98,28.27 U3.2
  Bottom 0.254: v29.25,29.25 v38.35,29.25
U3_AIN1_+
  Top 0.254: U3.10 34.77,23.07 26.18,14.48 26.18,10.22 29.25,7.15 29.25,4.55 SV1.8
U3_AIN1_-
  Top 0.254: U3.11 34.77,22.43 32.5,20.15 26.95,14.6 26.95,10.75 30.52,7.18 SV1.7
U3_AIN2_+
  Top 0.254: U3.12 34.77,21.77 27.74,14.74 27.74,11.06 31.85,6.95 31.85,4.49 SV1.6
U3_AIN2_-
  Top 0.254: U3.13 38.02,21.77 37.05,20.8 34.45,20.8 28.49,14.84 28.49,11.41 33.05,6.85 SV1.5
U3_MCLK_OUT  (via drill 0.7)
  Top 0.254: U3.3 39.33,27.62 40.3,28.6 v40.3,29.25 | v49.4,29.25 49.4,28.6 49.08,28.27 U4.2
  Bottom 0.254: v40.3,29.25 v49.4,29.25
U4_AIN1_+
  Top 0.254: U4.10 45.83,23.07 43.55,20.8 37.7,20.8 37.05,20.15 34.45,20.15 32.5,18.2 29.25,14.95 29.25,11.7 34.3,6.65 34.3,4.58 SV1.4
U4_AIN1_-
  Top 0.254: U4.11 45.83,22.43 43.55,20.15 37.7,20.15 37.05,19.5 34.45,19.5 32.5,17.55 29.98,15.03 29.98,12.27 35.6,6.65 SV1.3
U4_AIN2_+
  Top 0.254: U4.12 45.83,21.77 43.55,19.5 37.7,19.5 37.05,18.85 34.45,18.85 32.5,16.9 30.75,15.15 30.75,12.8 36.85,6.7 36.85,4.57 SV1.2
U4_AIN2_-
  Top 0.254: U4.13 49.08,21.77 48.1,20.8 45.5,20.8 43.55,18.85 37.7,18.85 37.05,18.2 34.45,18.2 32.5,16.25 31.41,15.15 31.41,13.45 38.14,6.71 SV1.1
U4_MCLK_OUT  (via drill 0.7)
  Top 0.254: U4.3 50.38,27.62 51.35,28.6 v51.35,29.25
  Bottom 0.254: v51.35,29.25 54.9,29.25 56.55,27.6 56.55,25.37 60.17,21.75 75.26,21.75 77.26,19.75 77.26,16.66 76.53,15.93 U5.2
U5_AIN1_+
  Bottom 0.254: U5.10 75.89,10.72 76.57,10.04 76.57,8.86 76.16,8.45 71.4,8.45 69.8,6.85 63.45,6.85 60.27,3.67 60.27,3.25 SV2.2
U5_AIN1_-
  Bottom 0.254: U5.11 75.87,10.07 76.1,9.85 76.1,9.05 75.9,8.85 71.15,8.85 69.55,7.25 61.7,7.25 60.3,5.85 60.27,5.85 SV2.1
U5_AIN2_+
  Bottom 0.254: SV2.4 57.7,3.3 58.9,4.5 58.9,6.42 59.43,6.95 60.35,6.95 61.05,7.65 69.25,7.65 71.03,9.43 U5.12
U5_AIN2_-
  Bottom 0.254: SV2.3 57.7,6.95 58.15,7.4 60.15,7.4 60.8,8.05 65.75,8.05 67.12,9.43 U5.13
U5_MCLK_OUT  (via drill 0.7)
  Top 0.254: v70.85,16.9 v61.75,16.9
  Bottom 0.254: U5.3 71.83,15.28 70.85,16.25 v70.85,16.9 | v61.75,16.9 61.75,16.25 62.08,15.93 U6.2
U6_AIN1_+
  Bottom 0.254: SV2.6 55.23,3.28 56.4,4.45 56.4,7.22 57.03,7.85 59.95,7.85 60.55,8.45 65.17,8.45 65.65,8.93 65.65,10.15 65.08,10.72 U6.10
U6_AIN1_-
  Bottom 0.254: U6.11 64.87,10.07 65.11,9.84 65.11,9.12 64.84,8.85 60.3,8.85 59.8,8.35 56.7,8.35 55.15,6.8 SV2.5
U6_AIN2_+
  Bottom 0.254: SV2.8 53.95,4.61 53.95,6.5 56.3,8.85 59.65,8.85 60.23,9.43 U6.12
U6_AIN2_-
  Bottom 0.254: U6.13 55.98,9.43 52.62,6.07 SV2.7
U6_MCLK_OUT  (via drill 0.7)
  Top 0.254: v50.7,16.9 v59.8,16.9
  Bottom 0.254: U6.3 60.77,15.28 59.8,16.25 v59.8,16.9 | U7.2 51.02,15.93 50.7,16.25 v50.7,16.9
U7_AIN1_+
  Bottom 0.254: U7.10 54.08,10.72 54.6,10.2 54.6,8.92 52.78,7.1 51.9,7.1 51.36,6.56 51.35,6.56 51.35,4.55 SV2.10
U7_AIN1_-
  Bottom 0.254: U7.11 53.87,10.07 54.08,9.87 54.08,9.21 52.62,7.75 51.65,7.75 50.08,6.18 SV2.9
U7_AIN2_+
  Bottom 0.254: SV2.12 47.54,3.34 48.8,4.6 48.8,6.4 50.65,8.25 52.35,8.25 52.87,8.77 U7.12
U7_AIN2_-
  Bottom 0.254: SV2.11 47.54,9.4 | U7.13 47.48,9.43 47.5,9.4 47.54,9.4 | 47.55,9.4 47.54,9.4
U7_MCLK_OUT  (via drill 0.7)
  Top 0.254: v48.75,16.9 v39.65,16.9
  Bottom 0.254: U7.3 50.38,15.28 v48.75,16.9 | v39.65,16.9 39.65,16.25 39.98,15.93 U8.2
U8_AIN1_+
  Bottom 0.254: U8.10 42.87,10.72 46.25,7.35 46.25,4.53 SV2.14
U8_AIN1_-
  Bottom 0.254: SV2.13 45,7.94 42.86,10.07 U8.11
U8_AIN2_+
  Bottom 0.254: SV2.16 43.7,4.52 43.7,8.59 42.87,9.43 U8.12
U8_AIN2_-
  Bottom 0.254: U8.13 39.98,9.43 42.45,6.95 SV2.15
VDD
  Bottom 0.406: SV3.6 SV3.5
  Bottom 1.27: SV3.8 SV3.7 SV3.5 3.25,21.36 3.25,18.85
VSS
  Bottom 0.406: SV3.9 5.85,16.28 | 5.82,13.65 SV3.11
  Bottom 1.27: SV3.9 SV3.10 SV3.12 SV3.11 | 5.85,16.28 5.85,13.75

### Text on the board
bNames: Hitzmann 2017